# Altium schematic sheet IO Expander.SchDoc: IO Expander
size Letter; Author: AC/KC; Engineer: k.cotton; Organization: Cegep Limoilou; Address1: 1300, 8e Avenue; Address2: Québec, QC; Address3: Canada; Address4: G1J 5L5; SheetNumber: 1; SheetTotal: 1
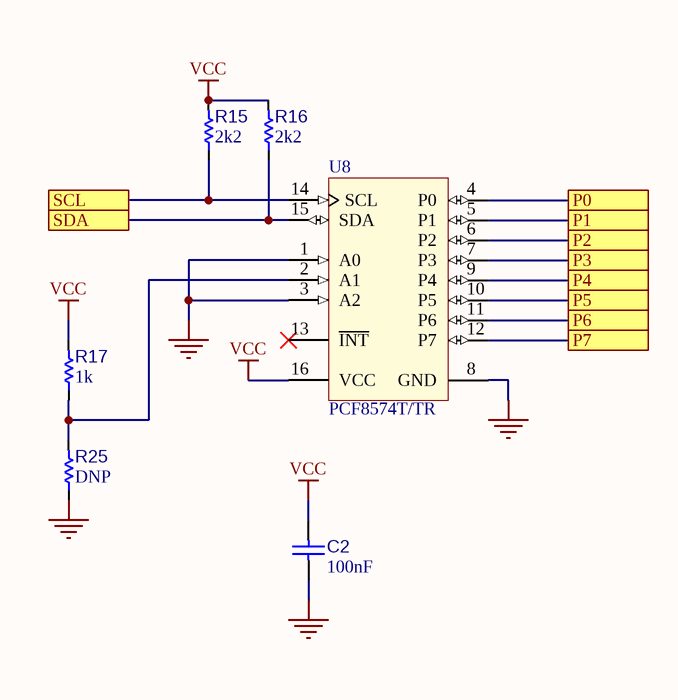
[diagram p0: IO Expander.SchDoc]

## Parts
C2  value 100nF  [C_1608[0603]]  (hidden comment: CAP CER 100nF 50V 0603)
R15  value 2k2  [R_1005[0402]]  (hidden comment: Res 2k2 1% 0402)
R16  value 2k2  [R_1005[0402]]  (hidden comment: Res 2k2 1% 0402)
R17  value 1k  [R_1608[0603]]  (hidden comment: Res 1k 1% 0603)
R25  value DNP  [R_1608[0603]]  (hidden comment: Res 1k 1% 0603)  (no BOM)
U8  PCF8574T/TR  [SOIC127P1030X265-16N]

## Ports
P0, P1, P2, P3, P4, P5, P6, P7, SCL, SDA

## Nets
GND: C2.1 R25.1 U8.1(A0) U8.3(A2) U8.8(GND)
VCC: C2.2 R15.2 R16.2 R17.2 U8.16(VCC)
P0: U8.4(P0) ; port P0
P1: U8.5(P1) ; port P1
P2: U8.6(P2) ; port P2
P3: U8.7(P3) ; port P3
P4: U8.9(P4) ; port P4
P5: U8.10(P5) ; port P5
P6: U8.11(P6) ; port P6
P7: U8.12(P7) ; port P7
SCL: R15.1 U8.14(SCL) ; port SCL
SDA: R16.1 U8.15(SDA) ; port SDA
NetR17_1: R17.1 R25.2 U8.2(A1)

Not connected (* = marked no-connect by the designer): U8 13(~{INT})*

## Notes on the sheet
- Titre :
- Conception :
- Date :
- Approbation :
- Heure :
- Révision :
- Feuille
- de
- Fichier :

## Library data of the parts
C2 = CAP002: Capacitor type 1; Manufacturer 1: Yageo; Manufacturer Part Number 1: CC0603KRX7R9BB104; LibRef: CAP002; Code CEGEP: COND0143SM; Tolerance: 10%; Dielectric: X7R; Rated Voltage: 50V; Mounting Technology: SMT; Supplier 1: LCSC; Supplier Part Number 1: C14663
R15 R16 = RES008: Resistor type 1; Manufacturer 1: Yageo; Manufacturer Part Number 1: RC0402FR-072K2L; LibRef: RES008; Code CEGEP: RES2.2KSM; Puissance: 1/16W; Max Working Voltage: 50V; Tolerance: 1%; Mounting Technology: SMT; Supplier 1: LCSC; Supplier Part Number 1: C114762; Supplier 2: Digi-Key; Supplier Part Number 2: 311-2.20KLRCT-ND
R17 R25 = RES015: Resistor type 1; Manufacturer 1: Yageo; Manufacturer Part Number 1: RC0603FR-071KL; LibRef: RES015; Puissance: 1/10W; Max Working Voltage: 75V; Tolerance: 1%; Mounting Technology: SMT; Supplier 1: LCSC; Supplier Part Number 1: C22548
U8 = U_PCF8574-SOIC: Remote 8-bit I/O expander for I2C-bus; Manufacturer 1: HG Semi; Code CEGEP: KIC8574SM; Localisation: R13-D030; Manufacturer Part Number 1: PCF8574T/TR; Supplier 1: LCSC; Supplier Part Number 1: C2987288; Manufacturer 2: TI; Manufacturer Part Number 2: PCF8574DWR; Supplier 2: Digikey; Supplier Part Number 2: 296-13108-1-ND; Mounting Technology: SMT